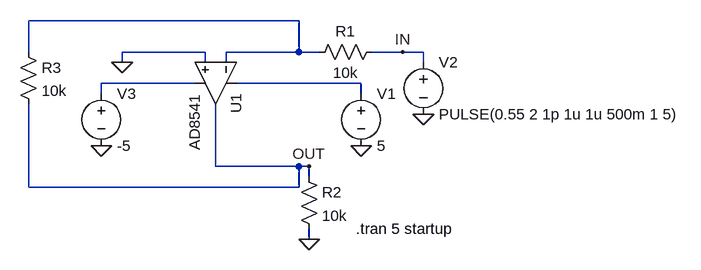
[diagram p0: schematic ad8541_inverting_amplifier.asc]
ad8541_inverting_amplifier.asc, the LTspice schematic file:
Version 4
SHEET 1 1468 1396
WIRE -144 672 -560 672
WIRE -560 720 -560 672
WIRE -288 720 -416 720
WIRE -144 720 -144 672
WIRE -144 720 -256 720
WIRE -112 720 -144 720
WIRE 16 720 -32 720
WIRE 48 720 16 720
WIRE -416 736 -416 720
WIRE -288 736 -288 720
WIRE -256 736 -256 720
WIRE 48 736 48 720
WIRE -304 768 -448 768
WIRE -48 768 -240 768
WIRE -448 784 -448 768
WIRE -48 784 -48 768
WIRE -272 896 -272 800
WIRE -144 896 -272 896
WIRE -128 896 -144 896
WIRE -128 912 -128 896
WIRE -560 928 -560 800
WIRE -144 928 -144 896
WIRE -144 928 -560 928
WIRE -128 1008 -128 992
FLAG -128 896 OUT
FLAG -128 1008 0
FLAG 48 816 0
FLAG -416 736 0
FLAG -448 864 0
FLAG -48 864 0
FLAG 16 720 IN
SYMBOL res -144 896 R0
SYMATTR InstName R2
SYMATTR Value 10k
SYMBOL voltage -48 768 R0
WINDOW 123 0 0 Left 2
WINDOW 39 0 0 Left 2
SYMATTR InstName V1
SYMATTR Value 5
SYMBOL voltage 48 720 R0
WINDOW 123 0 0 Left 2
WINDOW 39 0 0 Left 2
SYMATTR InstName V2
SYMATTR Value PULSE(0.55 2 1p 1u 1u 500m 1 5)
SYMBOL res -576 704 R0
SYMATTR InstName R3
SYMATTR Value 10k
SYMBOL voltage -448 768 R0
WINDOW 123 0 0 Left 2
WINDOW 39 0 0 Left 2
SYMATTR InstName V3
SYMATTR Value -5
SYMBOL res -16 704 R90
WINDOW 0 0 56 VBottom 2
WINDOW 3 32 56 VTop 2
SYMATTR InstName R1
SYMATTR Value 10k
SYMBOL Opamps\\AD8541 -208 768 R90
SYMATTR InstName U1
TEXT -56 992 Left 2 !.tran 5 startup

The netlist it stands for:
* ad8541_inverting_amplifier.asc
R2 OUT 0 10k
V1 N003 0 5
V2 IN 0 PULSE(0.55 2 1p 1u 1u 500m 1 5)
R3 N001 OUT 10k
V3 N002 0 -5
R1 IN N001 10k
XU1 0 N001 N003 N002 OUT AD8541  ; pins In+ In- V+ V- OUT
.tran 5 startup
.backanno
.end